# Altium project HIGH.PrjPcb
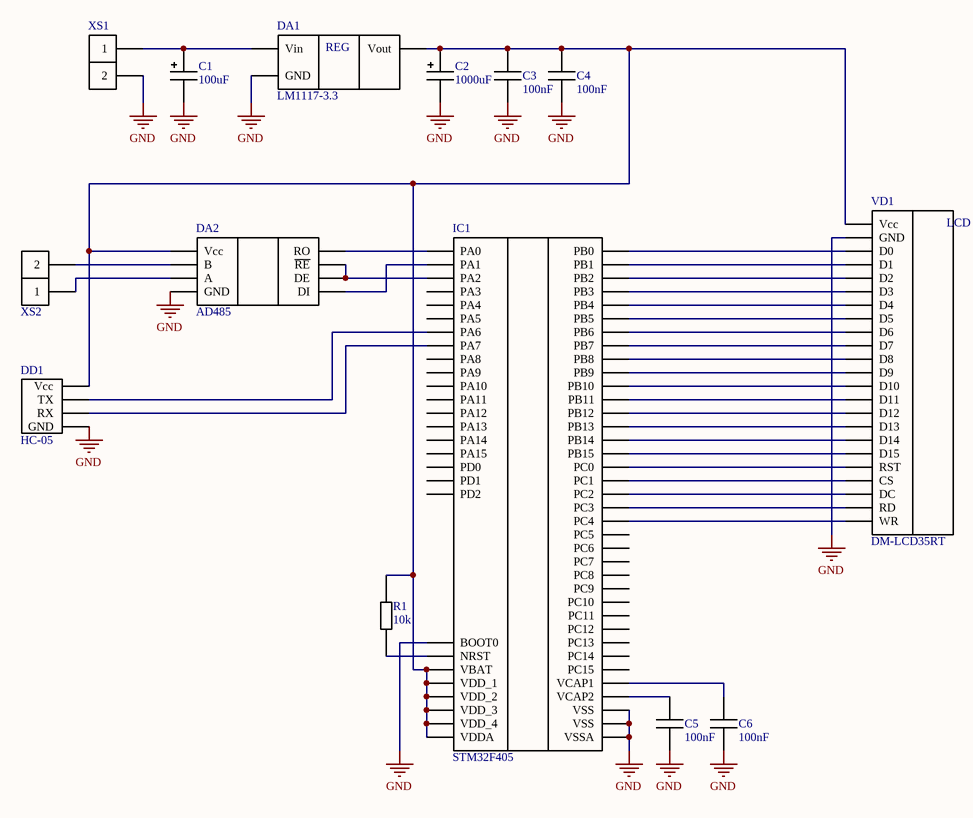
[diagram p0: high.SchDoc]
1 sheet, 14 parts. Net scope: global (net labels, ports and power ports of the same name join across sheets).

## Sheet high.SchDoc
size A4

### Parts
C1  100uF
C2  1000uF
C3  100nF
C4  100nF
C5  100nF
C6  100nF
DA1  LM1117-3.3
DA2  AD485
DD1  HC-05
IC1  STM32F405
R1  10k
VD1  DM-LCD35RT
XS1  CONN-2  (value not drawn)
XS2  CONN-2  (value not drawn)

### Nets
GND: C1.2 C2.2 C3.2 C4.2 C5.2 C6.2 DA1.3(GND) DA2.5(GND) DD1.5(GND) IC1.12(VSSA) IC1.18(VSS) IC1.60(BOOT0) IC1.63(VSS) VD1.16(GND) XS1.2
NetC1_1: C1.1 DA1.1(Vin) XS1.1
NetC2_1: C2.1 C3.1 C4.1 DA1.2(Vout) DA2.8(Vcc) DD1.8(Vcc) IC1.1(VBAT) IC1.13(VDDA) IC1.19(VDD_4) IC1.32(VDD_1) IC1.48(VDD_2) IC1.64(VDD_3) R1.1 VD1.15(Vcc)
NetC5_1: C5.1 IC1.47(VCAP2)
NetC6_1: C6.1 IC1.31(VCAP1)
NetDA2_1: DA2.1(RO) IC1.14(PA0)
NetDA2_2: DA2.2(~{RE}) DA2.3(DE) IC1.16(PA2)
NetDA2_4: DA2.4(DI) IC1.15(PA1)
NetDA2_6: DA2.6(A) XS2.1
NetDA2_7: DA2.7(B) XS2.2
NetDD1_6: DD1.6(RX) IC1.23(PA7)
NetDD1_7: DD1.7(TX) IC1.22(PA6)
NetIC1_7: IC1.7(NRST) R1.2
NetIC1_8: IC1.8(PC0) VD1.34(RST)
NetIC1_9: IC1.9(PC1) VD1.35(CS)
NetIC1_10: IC1.10(PC2) VD1.36(DC)
NetIC1_11: IC1.11(PC3) VD1.37(RD)
NetIC1_24: IC1.24(PC4) VD1.38(WR)
NetIC1_26: IC1.26(PB0) VD1.17(D0)
NetIC1_27: IC1.27(PB1) VD1.18(D1)
NetIC1_28: IC1.28(PB2) VD1.19(D2)
NetIC1_29: IC1.29(PB10) VD1.27(D10)
NetIC1_30: IC1.30(PB11) VD1.28(D11)
NetIC1_33: IC1.33(PB12) VD1.29(D12)
NetIC1_34: IC1.34(PB13) VD1.30(D13)
NetIC1_35: IC1.35(PB14) VD1.31(D14)
NetIC1_36: IC1.36(PB15) VD1.32(D15)
NetIC1_55: IC1.55(PB3) VD1.20(D3)
NetIC1_56: IC1.56(PB4) VD1.21(D4)
NetIC1_57: IC1.57(PB5) VD1.22(D5)
NetIC1_58: IC1.58(PB6) VD1.23(D6)
NetIC1_59: IC1.59(PB7) VD1.24(D7)
NetIC1_61: IC1.61(PB8) VD1.25(D8)
NetIC1_62: IC1.62(PB9) VD1.26(D9)

Not connected (* = marked no-connect by the designer): IC1 2(PC13) 3(PC14) 4(PC15) 5(PD0) 6(PD1) 17(PA3) 20(PA4) 21(PA5) 25(PC5) 37(PC6) 38(PC7) 39(PC8) 40(PC9) 41(PA8) 42(PA9) 43(PA10) 44(PA11) 45(PA12) 46(PA13) 49(PA14) 50(PA15) 51(PC10) 52(PC11) 53(PC12) 54(PD2)

### Notes on the sheet
- (in symbol LM1117-3.3) REG

### Library data of the parts
C1 C2 = CAP_POLAR
C3-C6 = CAP_NONPOLAR
DD1 = BT
IC1 = STM32F405: STM32 ARM-based 32-bit MCU; Order Number: STM32F405RGT6; Value: STM32F405RGT6; Package: LQFP-64; Distributor: STMicroelectronics
R1 = RES
VD1 = LCD